# Altium schematic sheet ECU_AutoRC_UC1_r00.SchDoc
size A4; SheetNumber: 3; SheetTotal: 8
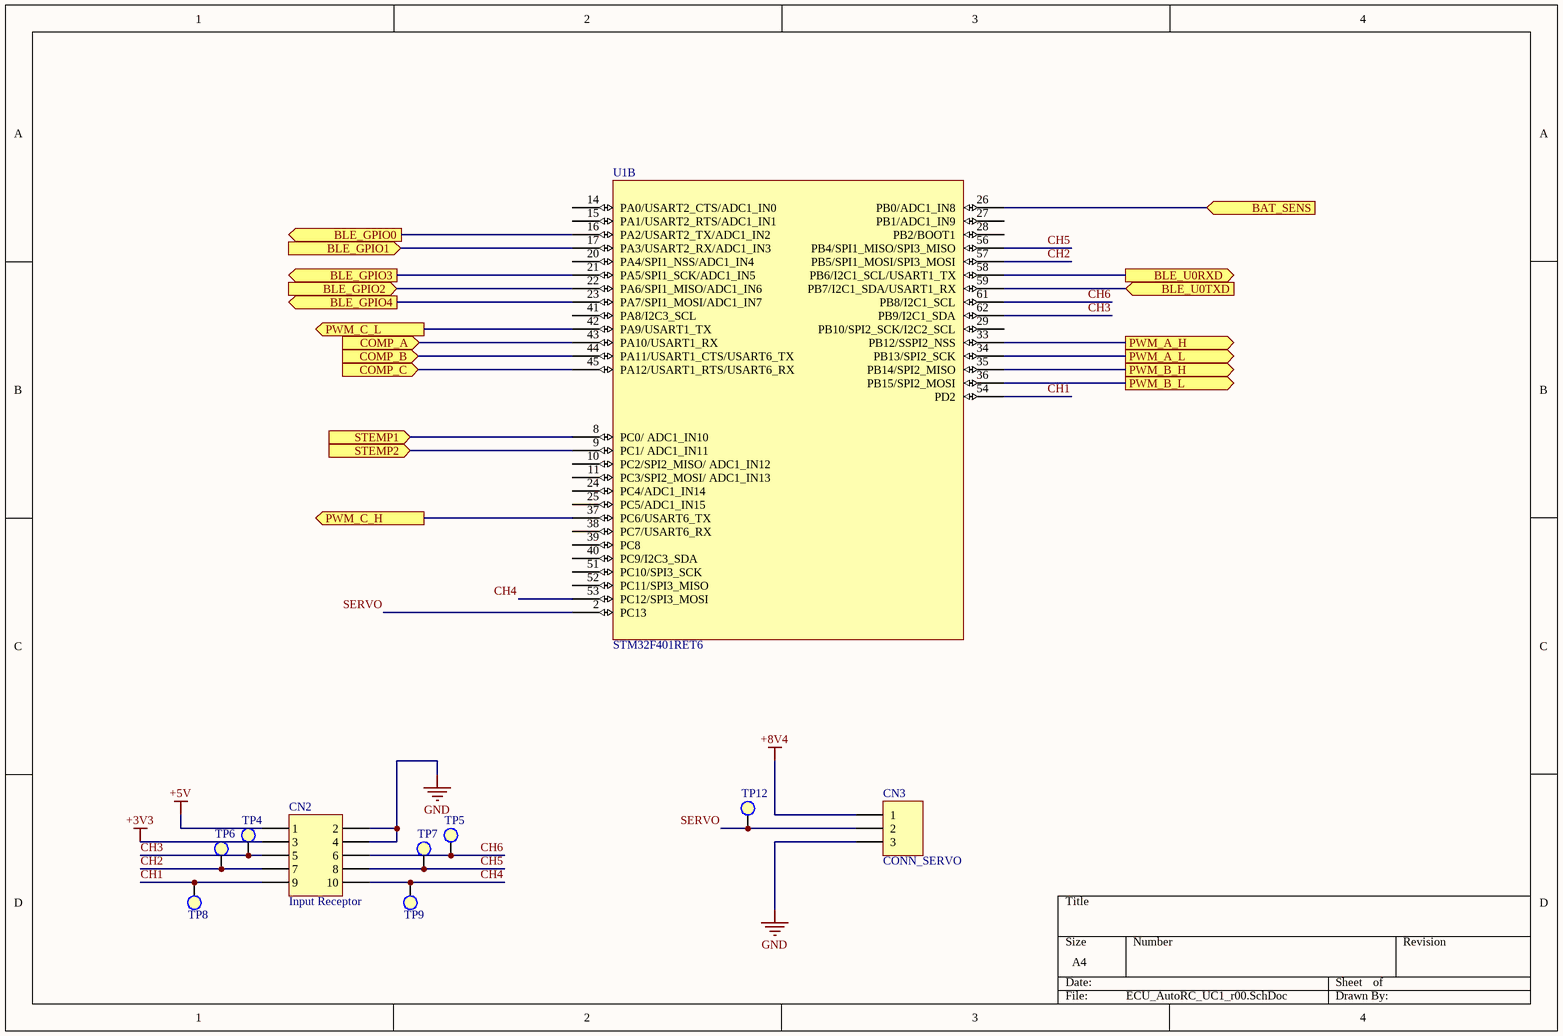
[diagram p0: ECU_AutoRC_UC1_r00.SchDoc]

## Parts
CN2  Input Receptor  [HEADER_M_2X5_2.54MM]
CN3  CONN_SERVO  [HEADER_M_1X3_2.5MM]
TP4  Test Point  [TEST_POINT]  (value not drawn)
TP5  Test Point  [TEST_POINT]  (value not drawn)
TP6  Test Point  [TEST_POINT]  (value not drawn)
TP7  Test Point  [TEST_POINT]  (value not drawn)
TP8  Test Point  [TEST_POINT]  (value not drawn)
TP9  Test Point  [TEST_POINT]  (value not drawn)
TP12  Test Point  [TEST_POINT]  (value not drawn)
U1  STM32F401RET6  [STM32F401T6]  (part B of 2)

## Ports
BAT_SENS (in, see ECU_AutoRC_BLK_r00[2B], ECU_AutoRC_PWR_SUPPLY_6A_r00[4C]), BLE_GPIO0 (out, see ECU_AutoRC_BLK_r00[2C], ECU_AutoRC_BLE_r00[1C]), BLE_GPIO1 (in, see ECU_AutoRC_BLK_r00[2C], ECU_AutoRC_BLE_r00[1C]), BLE_GPIO2 (in, see ECU_AutoRC_BLK_r00[2C], ECU_AutoRC_BLE_r00[1C]), BLE_GPIO3 (out, see ECU_AutoRC_BLK_r00[2C], ECU_AutoRC_BLE_r00[1C]), BLE_GPIO4 (out, see ECU_AutoRC_BLK_r00[2C], ECU_AutoRC_BLE_r00[1D]), BLE_U0RXD (out, see ECU_AutoRC_BLK_r00[2C], ECU_AutoRC_BLE_r00[1D]), BLE_U0TXD (in, see ECU_AutoRC_BLK_r00[2C], ECU_AutoRC_BLE_r00[1D]), COMP_A (in, see ECU_AutoRC_BLK_r00[3C], ECU_AutoRC_MOT_BEMF_r00[2C]), COMP_B (in, see ECU_AutoRC_BLK_r00[3C], ECU_AutoRC_MOT_BEMF_r00[2C]), COMP_C (in, see ECU_AutoRC_BLK_r00[3C], ECU_AutoRC_MOT_BEMF_r00[2D]), PWM_A_H (out, see ECU_AutoRC_BLK_r00[3C], ECU_AutoRC_MOT_DRIVER_r00[1A]), PWM_A_L (out, see ECU_AutoRC_BLK_r00[3C], ECU_AutoRC_MOT_DRIVER_r00[1A]), PWM_B_H (out, see ECU_AutoRC_BLK_r00[3C], ECU_AutoRC_MOT_DRIVER_r00[1B]), PWM_B_L (out, see ECU_AutoRC_BLK_r00[3C], ECU_AutoRC_MOT_DRIVER_r00[1B]), PWM_C_H (out, see ECU_AutoRC_BLK_r00[3C], ECU_AutoRC_MOT_DRIVER_r00[1B]), PWM_C_L (out, see ECU_AutoRC_BLK_r00[3C], ECU_AutoRC_MOT_DRIVER_r00[1B]), STEMP1 (in, see ECU_AutoRC_BLK_r00[3B], ECU_AutoRC_STEMP_r00[2A]), STEMP2 (in, see ECU_AutoRC_BLK_r00[3B], ECU_AutoRC_STEMP_r00[4A])

## Nets
+3V3: CN2.3
+5V: CN2.1
+8V4: CN3.1
GND: CN2.2 CN2.4 CN3.3
BAT_SENS: U1.26(PB0/ADC1_IN8) ; port BAT_SENS
BLE_GPIO0: U1.16(PA2/USART2_TX/ADC1_IN2) ; port BLE_GPIO0
BLE_GPIO1: U1.17(PA3/USART2_RX/ADC1_IN3) ; port BLE_GPIO1
BLE_GPIO2: U1.22(PA6/SPI1_MISO/ADC1_IN6) ; port BLE_GPIO2
BLE_GPIO3: U1.21(PA5/SPI1_SCK/ADC1_IN5) ; port BLE_GPIO3
BLE_GPIO4: U1.23(PA7/SPI1_MOSI/ADC1_IN7) ; port BLE_GPIO4
BLE_U0RXD: U1.58(PB6/I2C1_SCL/USART1_TX) ; port BLE_U0RXD
BLE_U0TXD: U1.59(PB7/I2C1_SDA/USART1_RX) ; port BLE_U0TXD
CH1: CN2.9 TP8.1 U1.54(PD2)
CH2: CN2.7 TP6.1 U1.57(PB5/SPI1_MOSI/SPI3_MOSI)
CH3: CN2.5 TP4.1 U1.62(PB9/I2C1_SDA)
CH4: CN2.10 TP9.1 U1.53(PC12/SPI3_MOSI)
CH5: CN2.8 TP7.1 U1.56(PB4/SPI1_MISO/SPI3_MISO)
CH6: CN2.6 TP5.1 U1.61(PB8/I2C1_SCL)
COMP_A: U1.43(PA10/USART1_RX) ; port COMP_A
COMP_B: U1.44(PA11/USART1_CTS/USART6_TX) ; port COMP_B
COMP_C: U1.45(PA12/USART1_RTS/USART6_RX) ; port COMP_C
PWM_A_H: U1.33(PB12/SSPI2_NSS) ; port PWM_A_H
PWM_A_L: U1.34(PB13/SPI2_SCK) ; port PWM_A_L
PWM_B_H: U1.35(PB14/SPI2_MISO) ; port PWM_B_H
PWM_B_L: U1.36(PB15/SPI2_MOSI) ; port PWM_B_L
PWM_C_H: U1.37(PC6/USART6_TX) ; port PWM_C_H
PWM_C_L: U1.42(PA9/USART1_TX) ; port PWM_C_L
SERVO: CN3.2 TP12.1 U1.2(PC13)
STEMP1: U1.8(PC0/_ADC1_IN10) ; port STEMP1
STEMP2: U1.9(PC1/_ADC1_IN11) ; port STEMP2

Not connected (* = marked no-connect by the designer): U1 10(PC2/SPI2_MISO/_ADC1_IN12) 11(PC3/SPI2_MOSI/_ADC1_IN13) 14(PA0/USART2_CTS/ADC1_IN0) 15(PA1/USART2_RTS/ADC1_IN1) 20(PA4/SPI1_NSS/ADC1_IN4) 24(PC4/ADC1_IN14) 25(PC5/ADC1_IN15) 27(PB1/ADC1_IN9) 28(PB2/BOOT1) 29(PB10/SPI2_SCK/I2C2_SCL) 38(PC7/USART6_RX) 39(PC8) 40(PC9/I2C3_SDA) 41(PA8/I2C3_SCL) 51(PC10/SPI3_SCK) 52(PC11/SPI3_MISO)

## Library data of the parts
CN2 = CONN_10P: Connector Generic 10 Vias
CN3 = CONN_03P: 3 Pin Connector
TP4-TP9 TP12 = TestPoint
U1 = STM32F401RE: STM32 Microcontroller